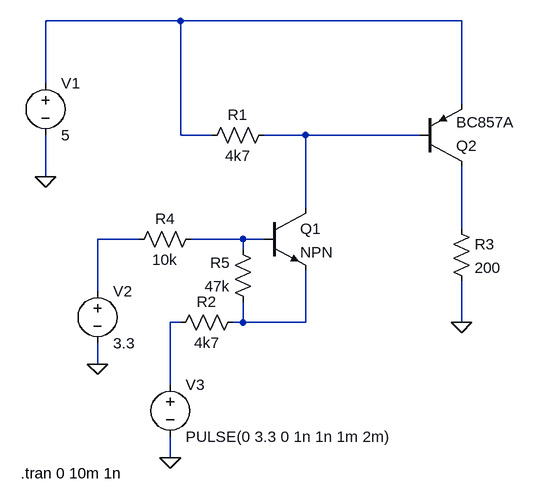
[diagram p0: schematic ism_en.asc]
ism_en.asc, the LTspice schematic file:
Version 4
SHEET 1 880 680
WIRE -112 -192 -320 -192
WIRE 320 -192 -112 -192
WIRE -320 -96 -320 -192
WIRE 320 -64 320 -192
WIRE -112 -16 -112 -192
WIRE -64 -16 -112 -16
WIRE 80 -16 16 -16
WIRE 256 -16 80 -16
WIRE -320 48 -320 -16
WIRE 80 96 80 -16
WIRE 320 128 320 32
WIRE -176 144 -240 144
WIRE -16 144 -96 144
WIRE 16 144 -16 144
WIRE -16 160 -16 144
WIRE -240 224 -240 144
WIRE -112 272 -128 272
WIRE -16 272 -16 240
WIRE -16 272 -32 272
WIRE 80 272 80 192
WIRE 80 272 -16 272
WIRE 320 272 320 208
WIRE -240 336 -240 304
WIRE -128 368 -128 272
WIRE -128 480 -128 448
FLAG -320 48 0
FLAG -240 336 0
FLAG -128 480 0
FLAG 320 272 0
SYMBOL npn 16 96 R0
SYMATTR InstName Q1
SYMBOL pnp 256 32 M180
SYMATTR InstName Q2
SYMATTR Value BC857A
SYMBOL res -80 0 R270
WINDOW 0 32 56 VTop 2
WINDOW 3 0 56 VBottom 2
SYMATTR InstName R1
SYMATTR Value 4k7
SYMBOL res -128 288 R270
WINDOW 0 32 56 VTop 2
WINDOW 3 0 56 VBottom 2
SYMATTR InstName R2
SYMATTR Value 4k7
SYMBOL sym_pal\ (1)\\voltage -320 -112 R0
WINDOW 123 0 0 Left 2
WINDOW 39 0 0 Left 2
SYMATTR InstName V1
SYMATTR Value 5
SYMBOL sym_pal\ (1)\\voltage -240 208 R0
WINDOW 123 0 0 Left 2
WINDOW 39 0 0 Left 2
SYMATTR InstName V2
SYMATTR Value 3.3
SYMBOL sym_pal\ (1)\\voltage -128 352 R0
WINDOW 123 0 0 Left 2
WINDOW 39 0 0 Left 2
SYMATTR InstName V3
SYMATTR Value PULSE(0 3.3 0 1n 1n 1m 2m)
SYMBOL res 304 112 R0
SYMATTR InstName R3
SYMATTR Value 200
SYMBOL res -192 160 R270
WINDOW 0 32 56 VTop 2
WINDOW 3 0 56 VBottom 2
SYMATTR InstName R4
SYMATTR Value 10k
SYMBOL res 0 256 R180
WINDOW 0 36 76 Left 2
WINDOW 3 36 40 Left 2
SYMATTR InstName R5
SYMATTR Value 47k
TEXT -358 504 Left 2 !.tran 0 10m 1n

The netlist it stands for:
* ism_en.asc
Q1 N002 N005 N007 0 NPN
Q2 N003 N002 N001 0 BC857A
R1 N001 N002 4k7
R2 N006 N007 4k7
V1 N001 0 5
V2 N004 0 3.3
V3 N006 0 PULSE(0 3.3 0 1n 1n 1m 2m)
R3 N003 0 200
R4 N004 N005 10k
R5 N007 N005 47k
.model NPN NPN
.model PNP PNP
.lib standard.bjt
.tran 0 10m 1n
.backanno
.end